# EAGLE design pdlab (EAGLE 9.6.2)
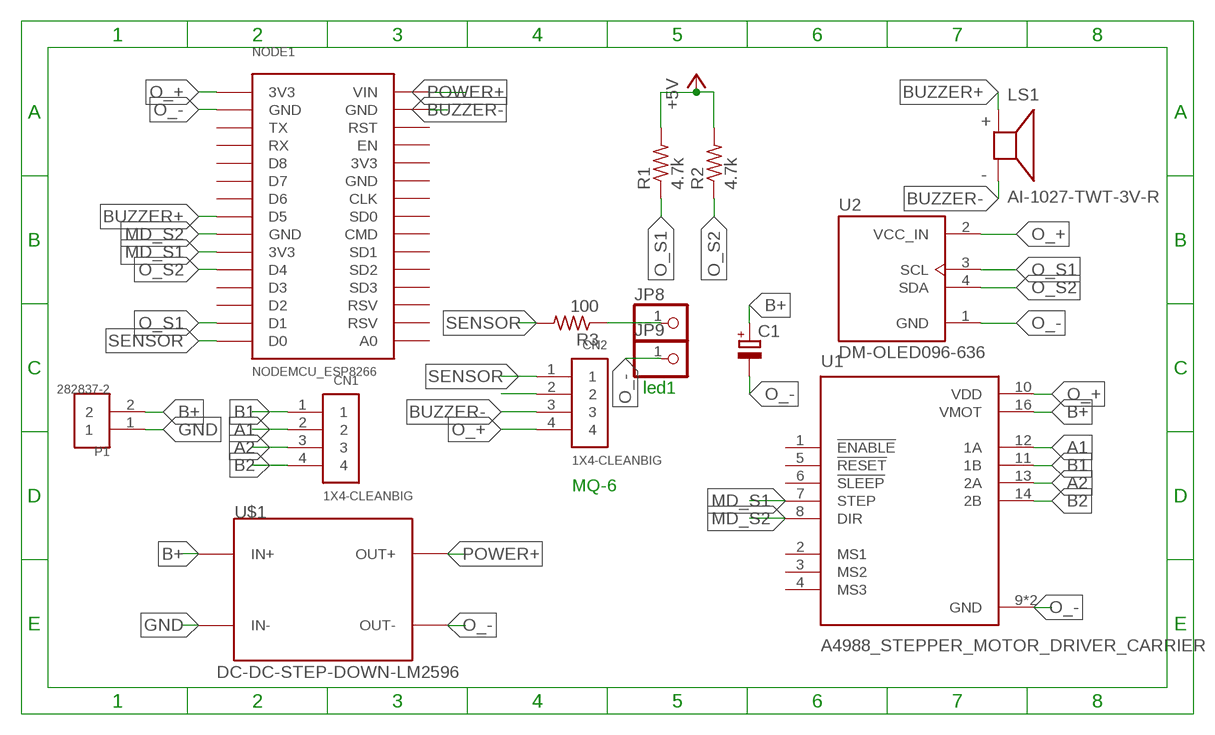
[diagram p0: schematic, sheet 1]

## Parts
C1  CPOL-EUE2,5-6E  [E2,5-6E]
CN1  1X4-CLEANBIG  [1X04-CLEANBIG]
CN2  1X4-CLEANBIG  [1X04-CLEANBIG]
JP8  PINHD-1X1CB  [1X01-CLEANBIG]
JP9  PINHD-1X1CB  [1X01-CLEANBIG]
LS1  AI-1027-TWT-3V-R  [XDCR_AI-1027-TWT-3V-R]
NODE1  NODEMCU_ESP8266  [NODEMCU_ESP8266]
P1  282837-2  [TE_282837-2]
R1  4.7k  R-US_0204/7  [0204/7]
R2  4.7k  R-US_0204/7  [0204/7]
R3  100  R-US_0204/7  [0204/7]
U1  A4988_STEPPER_MOTOR_DRIVER_CARRIER  [MODULE_A4988_STEPPER_MOTOR_DRIVER_CARRIER]
U2  DM-OLED096-636  [MODULE_DM-OLED096-636]
U$1  DC-DC-STEP-DOWN-LM2596  [DC-DC-STEP-DOWN-LM2596]

## Nets
+5V: R1.2 R2.2
A1: CN1.2 U1.12(1A)
A2: CN1.3 U1.13(2A)
B1: CN1.1 U1.11(1B)
B2: CN1.4 U1.14(2B)
B+: C1.+ P1.2 U1.16(VMOT) U$1.IN+
BUZZER+: LS1.P NODE1.D5
BUZZER-: CN2.3 LS1.N NODE1.GND@4(GND)
GND: P1.1 U$1.IN-
MD_S1: NODE1.3V3@2(3V3) U1.7(STEP)
MD_S2: NODE1.GND@2(GND) U1.8(DIR)
N$2: CN2.2
N$14: JP8.1 R3.1
O_+: CN2.4 NODE1.3V3@1(3V3) U1.10(VDD) U2.2(VCC_IN)
O_-: C1.- JP9.1 NODE1.GND@1(GND) U1.9(GND) U1.15(GND) U2.1(GND) U$1.OUT-
O_S1: NODE1.D1 R1.1 U2.3(SCL)
O_S2: NODE1.D4 R2.1 U2.4(SDA)
POWER+: NODE1.VIN U$1.OUT+
SENSOR: CN2.1 NODE1.D0 R3.2
Unconnected: NODE1.A0 NODE1.CLK NODE1.CMD NODE1.D2 NODE1.D3 NODE1.D6 NODE1.D7 NODE1.D8 NODE1.EN NODE1.RST NODE1.RSV1(RSV) NODE1.RSV2(RSV) NODE1.RX NODE1.SD1 NODE1.SD2 NODE1.SD3 NODE1.SDO(SD0) NODE1.TX U1.1(!ENABLE) U1.2(MS1) U1.3(MS2) U1.4(MS3) U1.5(!RESET) U1.6(!SLEEP)

## Notes on the sheet
- led1
- MQ-6

## Power pins joined to a net without a drawn wire
3V3: NODE1.3V3@3(3V3)
GND: NODE1.GND@3(GND)

## Library data of the parts
C1 = rcl:CPOL-EU: POLARIZED CAPACITOR, European symbol; SPICEPREFIX: C
CN1 CN2 = adafruit:1X4: 4-pin connector
JP8 JP9 = adafruit:PINHD-1X1: Pin header 1x1 for 0.1" spacing With round pins
LS1 = AI-1027-TWT-3V-R:AI-1027-TWT-3V-R: Check availability <https://pricing.snapeda.com/parts/AI-1027-TWT-3V-R/PUI%20Audio/view-part?ref=eda>; AVAILABILITY: In Stock; CHECK_PRICES: https://www.snapeda.com/parts/AI-1027-TWT-3V-R/PUI+Audio%252C+Inc./view-part/?ref=eda; DESCRIPTION: AUDIO INDICATOR 3VDC 30MA 80DBA 2700HZ; MF: PUI Audio; MP: AI-1027-TWT-3V-R; PACKAGE: None; PRICE: None; PURCHASE-URL: https://www.snapeda.com/api/url_track_click_mouser/?unipart_id=289257&manufacturer=PUI Audio&part_name=AI-1027-TWT-3V-R&search_term=buzzer; SNAPEDA_LINK: https://www.snapeda.com/parts/AI-1027-TWT-3V-R/PUI+Audio%252C+Inc./view-part/?ref=snap
NODE1 = nodemcu_esp8266:NODEMCU_ESP8266: Node MCU V2 (ESP8266) Created by Harish
P1 = 282837-2:282837-2: TERM BLOCK 5.08MM 2POS SIDE ENTY Check availability <https://pricing.snapeda.com/parts/282837-2/TE%20Connectivity/view-part?ref=eda>; AVAILABILITY: In Stock; CHECK_PRICES: https://www.snapeda.com/parts/282837-2/TE+Connectivity+AMP+Connectors/view-part/?ref=eda; COMMENT: 282837-2; DESCRIPTION: Terminal Block Connector Wire Receptacle 2 5.08 mm 30-16 AWG Green 13.5 A 250 V | TE Connectivity 282837-2; MF: TE Connectivity; MP: 282837-2; PACKAGE: None; PRICE: None; PURCHASE-URL: https://www.snapeda.com/api/url_track_click_mouser/?unipart_id=2549980&manufacturer=TE Connectivity&part_name=282837-2&search_term=None; SNAPEDA_LINK: https://www.snapeda.com/parts/282837-2/TE+Connectivity+AMP+Connectors/view-part/?ref=snap
R1-R3 = rcl:R-US_: RESISTOR, American symbol; SPICEPREFIX: R
U1 = A4988_STEPPER_MOTOR_DRIVER_CARRIER:A4988_STEPPER_MOTOR_DRIVER_CARRIER: Stepper motor controler; IC: A4988; 1A; Uin mot: 8÷35V Check availability <https://pricing.snapeda.com/parts/A4988%20STEPPER%20MOTOR%20DRIVER%20CARRIER/Pololu/view-part?ref=eda>; AVAILABILITY: Not in stock; CHECK_PRICES: https://www.snapeda.com/parts/A4988%20STEPPER%20MOTOR%20DRIVER%20CARRIER/Pololu/view-part/?ref=eda; DESCRIPTION: Stepper Motor Driver; MF: Pololu; MP: A4988 STEPPER MOTOR DRIVER CARRIER; PACKAGE: None; PRICE: None; SNAPEDA_LINK: https://www.snapeda.com/parts/A4988%20STEPPER%20MOTOR%20DRIVER%20CARRIER/Pololu/view-part/?ref=snap
U2 = DM-OLED096-636:DM-OLED096-636: Check availability <https://pricing.snapeda.com/parts/DM-OLED096-636/Display%20Module/view-part?ref=eda>; AVAILABILITY: Not in stock; CHECK_PRICES: https://www.snapeda.com/parts/DM-OLED096-636/Display+Module/view-part/?ref=eda; DESCRIPTION: 0.96” 128 X 64 MONOCHROME GRAPHIC OLED DISPLAY MODULE - I2C; MF: Display Module; MP: DM-OLED096-636; PACKAGE: Package; PRICE: None; SNAPEDA_LINK: https://www.snapeda.com/parts/DM-OLED096-636/Display+Module/view-part/?ref=snap
U$1 = diy-modules:DC-DC-STEP-DOWN-LM2596: DC/DC Step-Down Regulator based on LM2596-ADJ chip

## Board
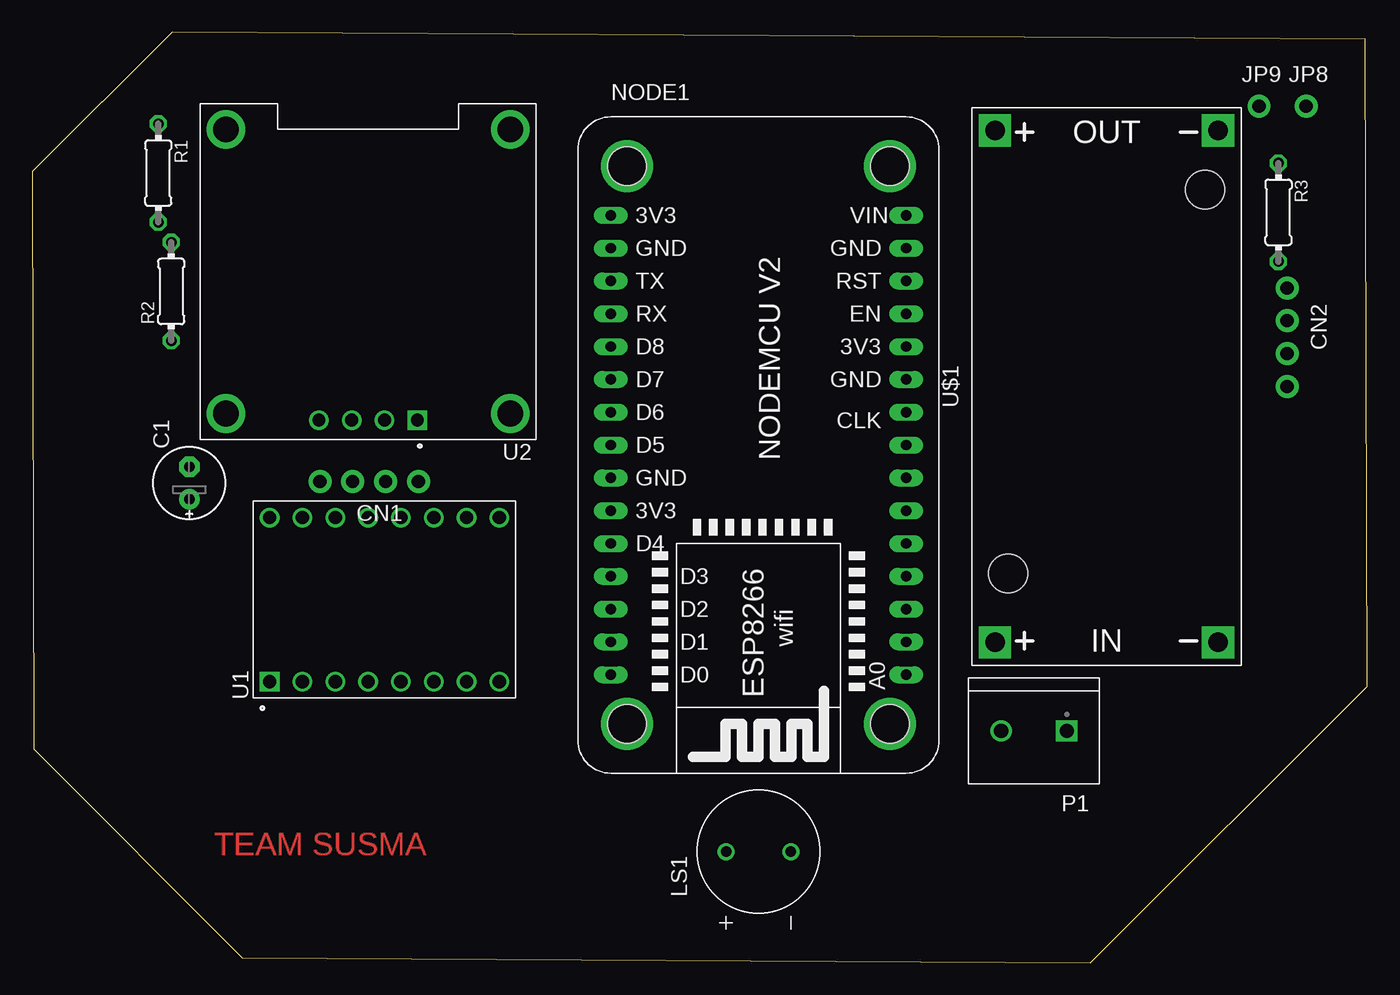
[diagram p1: board, top side]
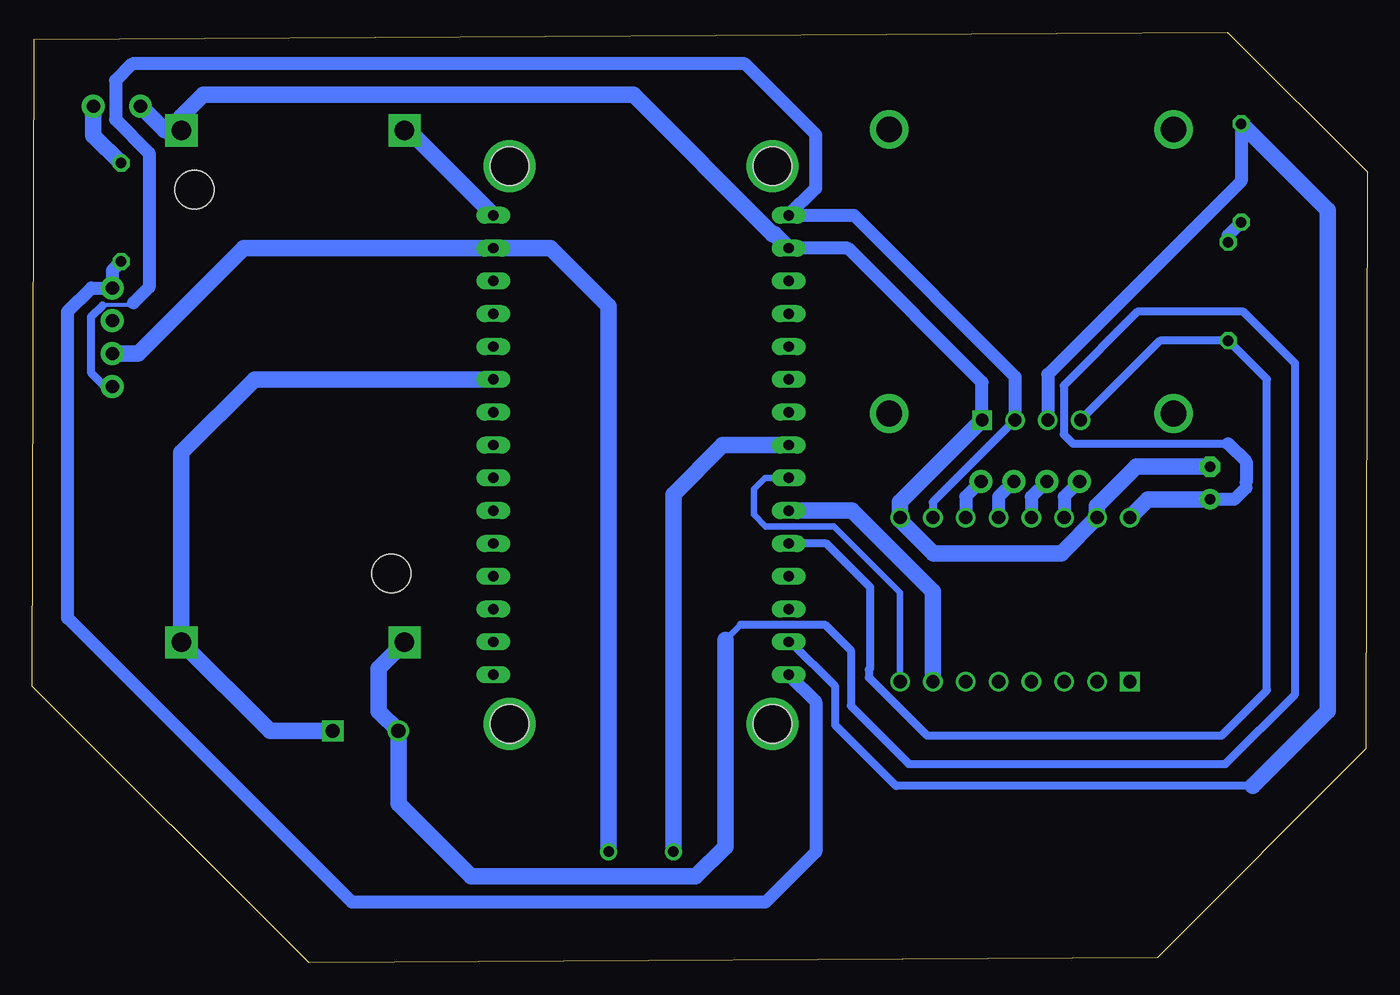
[diagram p2: board, bottom side, seen from below]

Size 103.31 x 72.01 mm. Coordinates in mm from the lower left corner, seen from the top.
Outline: 0,61.22 0.12,16.54 16.23,0.38 81.87,0 103.31,21.37 103.17,71.48 10.82,72.01 0,61.22
Copper layers (1*16): Top 0.035mm / dielectric 1.5mm / Bottom 0.035mm
Design rules "default": minimum track width 6mil, minimum drill 0.35mm, track to track 6mil, track to pad 6mil, pad to pad 6mil, via to via 6mil, smd to smd 6mil, copper to edge 40mil, drill to drill 6mil, minimum pad ring 10mil, minimum via ring 8mil, stop-mask expansion 4mil, vias tented up to drill 0mil, thermal gap 10mil

### Footprints (pad centres in the part's own frame; a part is rotated, then mirrored left to right if it is on the bottom)
E2,5-6E = drill 0.813 pad 1.575: + -1.27,0 | drill 0.813 pad 1.575 octagon: - 1.27,0
1X04-CLEANBIG = drill 1.016 pad 1.778: 1 -3.81,0; 2 -1.27,0; 3 1.27,0; 4 3.81,0
1X01-CLEANBIG = drill 1.016 pad 1.778: 1 0,0
XDCR_AI-1027-TWT-3V-R = drill 0.8: N 0,-2.5; P 0,2.5
NODEMCU_ESP8266 = drill 0.8 long: 3V3@1 -11.43,19.05; 3V3@2 -11.43,-3.81; 3V3@3 11.43,8.89; A0 11.43,-16.51; CLK 11.43,3.81; CMD 11.43,-1.27; D0 -11.43,-16.51; D1 -11.43,-13.97; D2 -11.43,-11.43; D3 -11.43,-8.89; D4 -11.43,-6.35; D5 -11.43,1.27; D6 -11.43,3.81; D7 -11.43,6.35; D8 -11.43,8.89; EN 11.43,11.43; GND@1 -11.43,16.51; GND@2 -11.43,-1.27; GND@3 11.43,6.35; GND@4 11.43,16.51; RST 11.43,13.97; RSV1 11.43,-11.43; RSV2 11.43,-13.97; RX -11.43,11.43; SD1 11.43,-3.81; SD2 11.43,-6.35; SD3 11.43,-8.89; SDO 11.43,1.27; TX -11.43,13.97; VIN 11.43,19.05 | drill 3: P$31 10.16,22.86; P$32 -10.16,22.86; P$33 -10.16,-20.32; P$34 10.16,-20.32 | hole 3: 10.16,22.86; 10.16,-20.32; -10.16,-20.32; -10.16,22.86
TE_282837-2 = drill 1.1 square: 1 -2.54,0 | drill 1.1: 2 2.54,0
0204/7 = drill 0.813 octagon: 1 -3.81,0; 2 3.81,0
MODULE_A4988_STEPPER_MOTOR_DRIVER_CARRIER = drill 1.02 square: 1 -6.35,8.89 | drill 1.02: 2 -6.35,6.35; 3 -6.35,3.81; 4 -6.35,1.27; 5 -6.35,-1.27; 6 -6.35,-3.81; 7 -6.35,-6.35; 8 -6.35,-8.89; 9 6.35,-8.89; 10 6.35,-6.35; 11 6.35,-3.81; 12 6.35,-1.27; 13 6.35,1.27; 14 6.35,3.81; 15 6.35,6.35; 16 6.35,8.89
MODULE_DM-OLED096-636 = drill 1 square: 1 -3.81,11.5 | drill 1: 2 -1.27,11.5; 3 1.27,11.5; 4 3.81,11.5 | drill 2: S1 -11,11; S2 11,11; S3 11,-11; S4 -11,-11
DC-DC-STEP-DOWN-LM2596 = drill 1.5 pad 2.5 square: IN+ -19.812,8.636; IN- -19.812,-8.636; OUT+ 19.812,8.636; OUT- 19.812,-8.636 | hole 3: -14.478,7.62; 15.24,-7.62

### Placement (x,y rotation side)
C1  12.15,37.13 90 top
CN1  26.07,37.26 180 top
CN2  97.11,48.42 270 top
JP8  98.58,66.3 0 top
JP9  94.94,66.3 0 top
LS1  56.2,8.59 90 top
NODE1  56.2,38.8 0 top
P1  77.52,17.94 180 top
R1  9.75,61.12 270 top
R2  10.75,51.96 90 top
R3  96.44,58.08 270 top
U1  27.26,28.1 90 top
U2  25.99,53.5 180 top
U$1  83.14,44.61 90 top

### Tracks (layer width: path | path; a pad name or v marks a point on that pad's centre or on a via)
+5V
  Bottom 1.016: R1.2 10.75,56.31 R2.2
A1
  Bottom 1.016: CN1.2 28.53,36.07 U1.12
A2
  Bottom 1.016: CN1.3 25.99,36.07 U1.13
B1
  Bottom 1.016: CN1.1 31.07,36.07 U1.11
B2
  Bottom 1.016: CN1.4 23.45,36.07 U1.14
B+
  Bottom 0.508: 49.67,24.98 48.47,26.18
  Bottom 0.61: 48.47,26.18 41.97,26.18 39.97,24.18 39.97,19.88 35.47,15.38 10.97,15.38 5.57,20.78 5.57,46.38 9.57,50.38 17.77,50.38 23.48,44.67 23.48,40.88 22.77,40.18 10.77,40.18 | 9.37,37.18 9.37,36.78
  Bottom 1.016: 10.77,40.18 9.37,38.78 9.37,37.18 | C1.+ 10.29,35.86 9.37,36.78
  Bottom 1.27: C1.+ 16.96,35.86 U1.16 | U$1.IN+ 76.5,22.79 76.5,19.46 P1.2 74.98,12.29 69.37,6.68 51.97,6.68 49.67,8.98 49.67,24.98
BUZZER+
  Bottom 1.27: NODE1.D5 49.88,40.07 53.7,36.25 LS1.P
BUZZER-
  Bottom 1.27: LS1.N 58.7,50.81 63.2,55.31 NODE1.GND@4 86.94,55.31 95.1,47.15 CN2.3
GND
  Bottom 1.27: NODE1.GND@3 86.1,45.15 91.78,39.47 U$1.IN- 84.92,17.94 P1.1
MD_S1
  Bottom 1.27: U1.7 33.61,28.72 39.88,34.99 NODE1.3V3@2
MD_S2
  Bottom 0.508: NODE1.GND@2 46.62,37.53 47.47,36.68 47.47,34.68 46.57,33.78 41.27,33.78 36.15,28.66 U1.8
N$14
  Bottom 1.27: R3.1 98.58,64.03 JP8.1
O_+
  Bottom 0.305: 97.87,50.88 97.61,50.88 97.6,50.88 95.67,50.88 95.47,51.08
  Bottom 0.61: U2.2 33.61,35.65 U1.10 | 97.87,50.88 98.77,49.98 98.77,45.68 97.7,44.61 CN2.4
  Bottom 1.016: U2.2 27.26,45.37 39.74,57.85 NODE1.3V3@1 42.67,59.95 42.67,64.08 48.17,69.58 95.57,69.58 96.87,68.28 96.87,65.28 94.27,62.68 94.27,52.28 95.47,51.08
O_-
  Bottom 1.016: U2.1 29.8,44.91 40.2,55.31 NODE1.GND@1
  Bottom 1.27: NODE1.GND@1 45.87,56.4 46.02,56.4 56.79,67.18 90.07,67.18 91.78,65.47 U$1.OUT- 93.06,64.42 JP9.1 | C1.- 17.85,38.4 20.91,35.34 U1.15 23.68,31.68 33.57,31.68 36.15,34.26 U1.9 36.15,35.65 U2.1
O_S1
  Bottom 0.61: 8.87,13.68 36.47,13.68 41.17,18.38 41.17,21.38 44.62,24.83 NODE1.D1
  Bottom 1.016: R1.1 9.75,60.5 24.72,45.53 U2.3
  Bottom 1.27: R1.1 3.07,58.25 3.07,19.48 8.87,13.68
O_S2
  Bottom 0.61: NODE1.D4 41.84,32.45 38.47,29.08 38.47,22.78 38.57,22.68 38.57,22.08 34.07,17.58 11.67,17.58 11.27,17.58 7.77,21.08 7.77,45.17 R2.1 16.03,48.15 U2.4
POWER+
  Bottom 1.27: NODE1.VIN 74.2,64.42 U$1.OUT+
SENSOR
  Bottom 1.016: NODE1.D0 42.67,20.19 42.67,8.58 46.57,4.68 78.57,4.68 100.57,26.68 100.57,50.38 98.72,52.23 CN2.1 97.11,53.6 R3.2

### Text on the board
Top: TEAM SUSMA